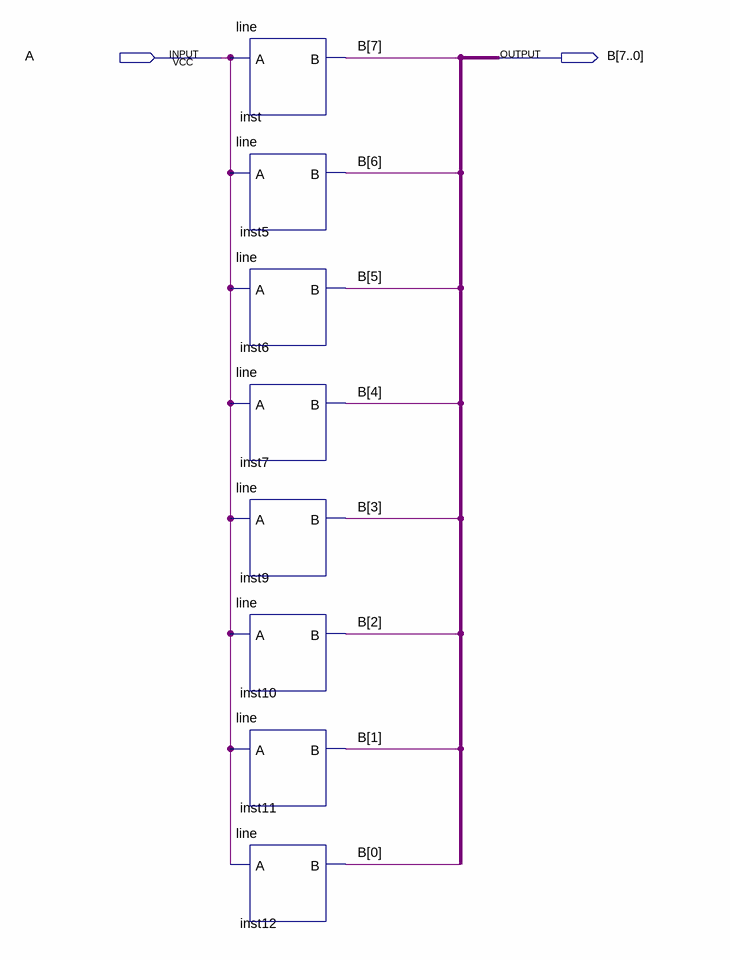
[diagram p0: schematic sheet]
// Quartus schematic splitter1_bus8.bdf as structural Verilog: 8 symbols, 2 pins
module splitter1_bus8 (
  input  A,
  output [7:0] B
);

  line inst (.A(A), .B(B[7]));
  line inst5 (.A(A), .B(B[6]));
  line inst6 (.A(A), .B(B[5]));
  line inst7 (.A(A), .B(B[4]));
  line inst9 (.A(A), .B(B[3]));
  line inst10 (.A(A), .B(B[2]));
  line inst11 (.A(A), .B(B[1]));
  line inst12 (.A(A), .B(B[0]));
endmodule
